# Altium schematic sheet RK3562-VCCIO4.SchDoc
size 420 x 297 mm; SheetNumber: 9; SheetTotal: 32
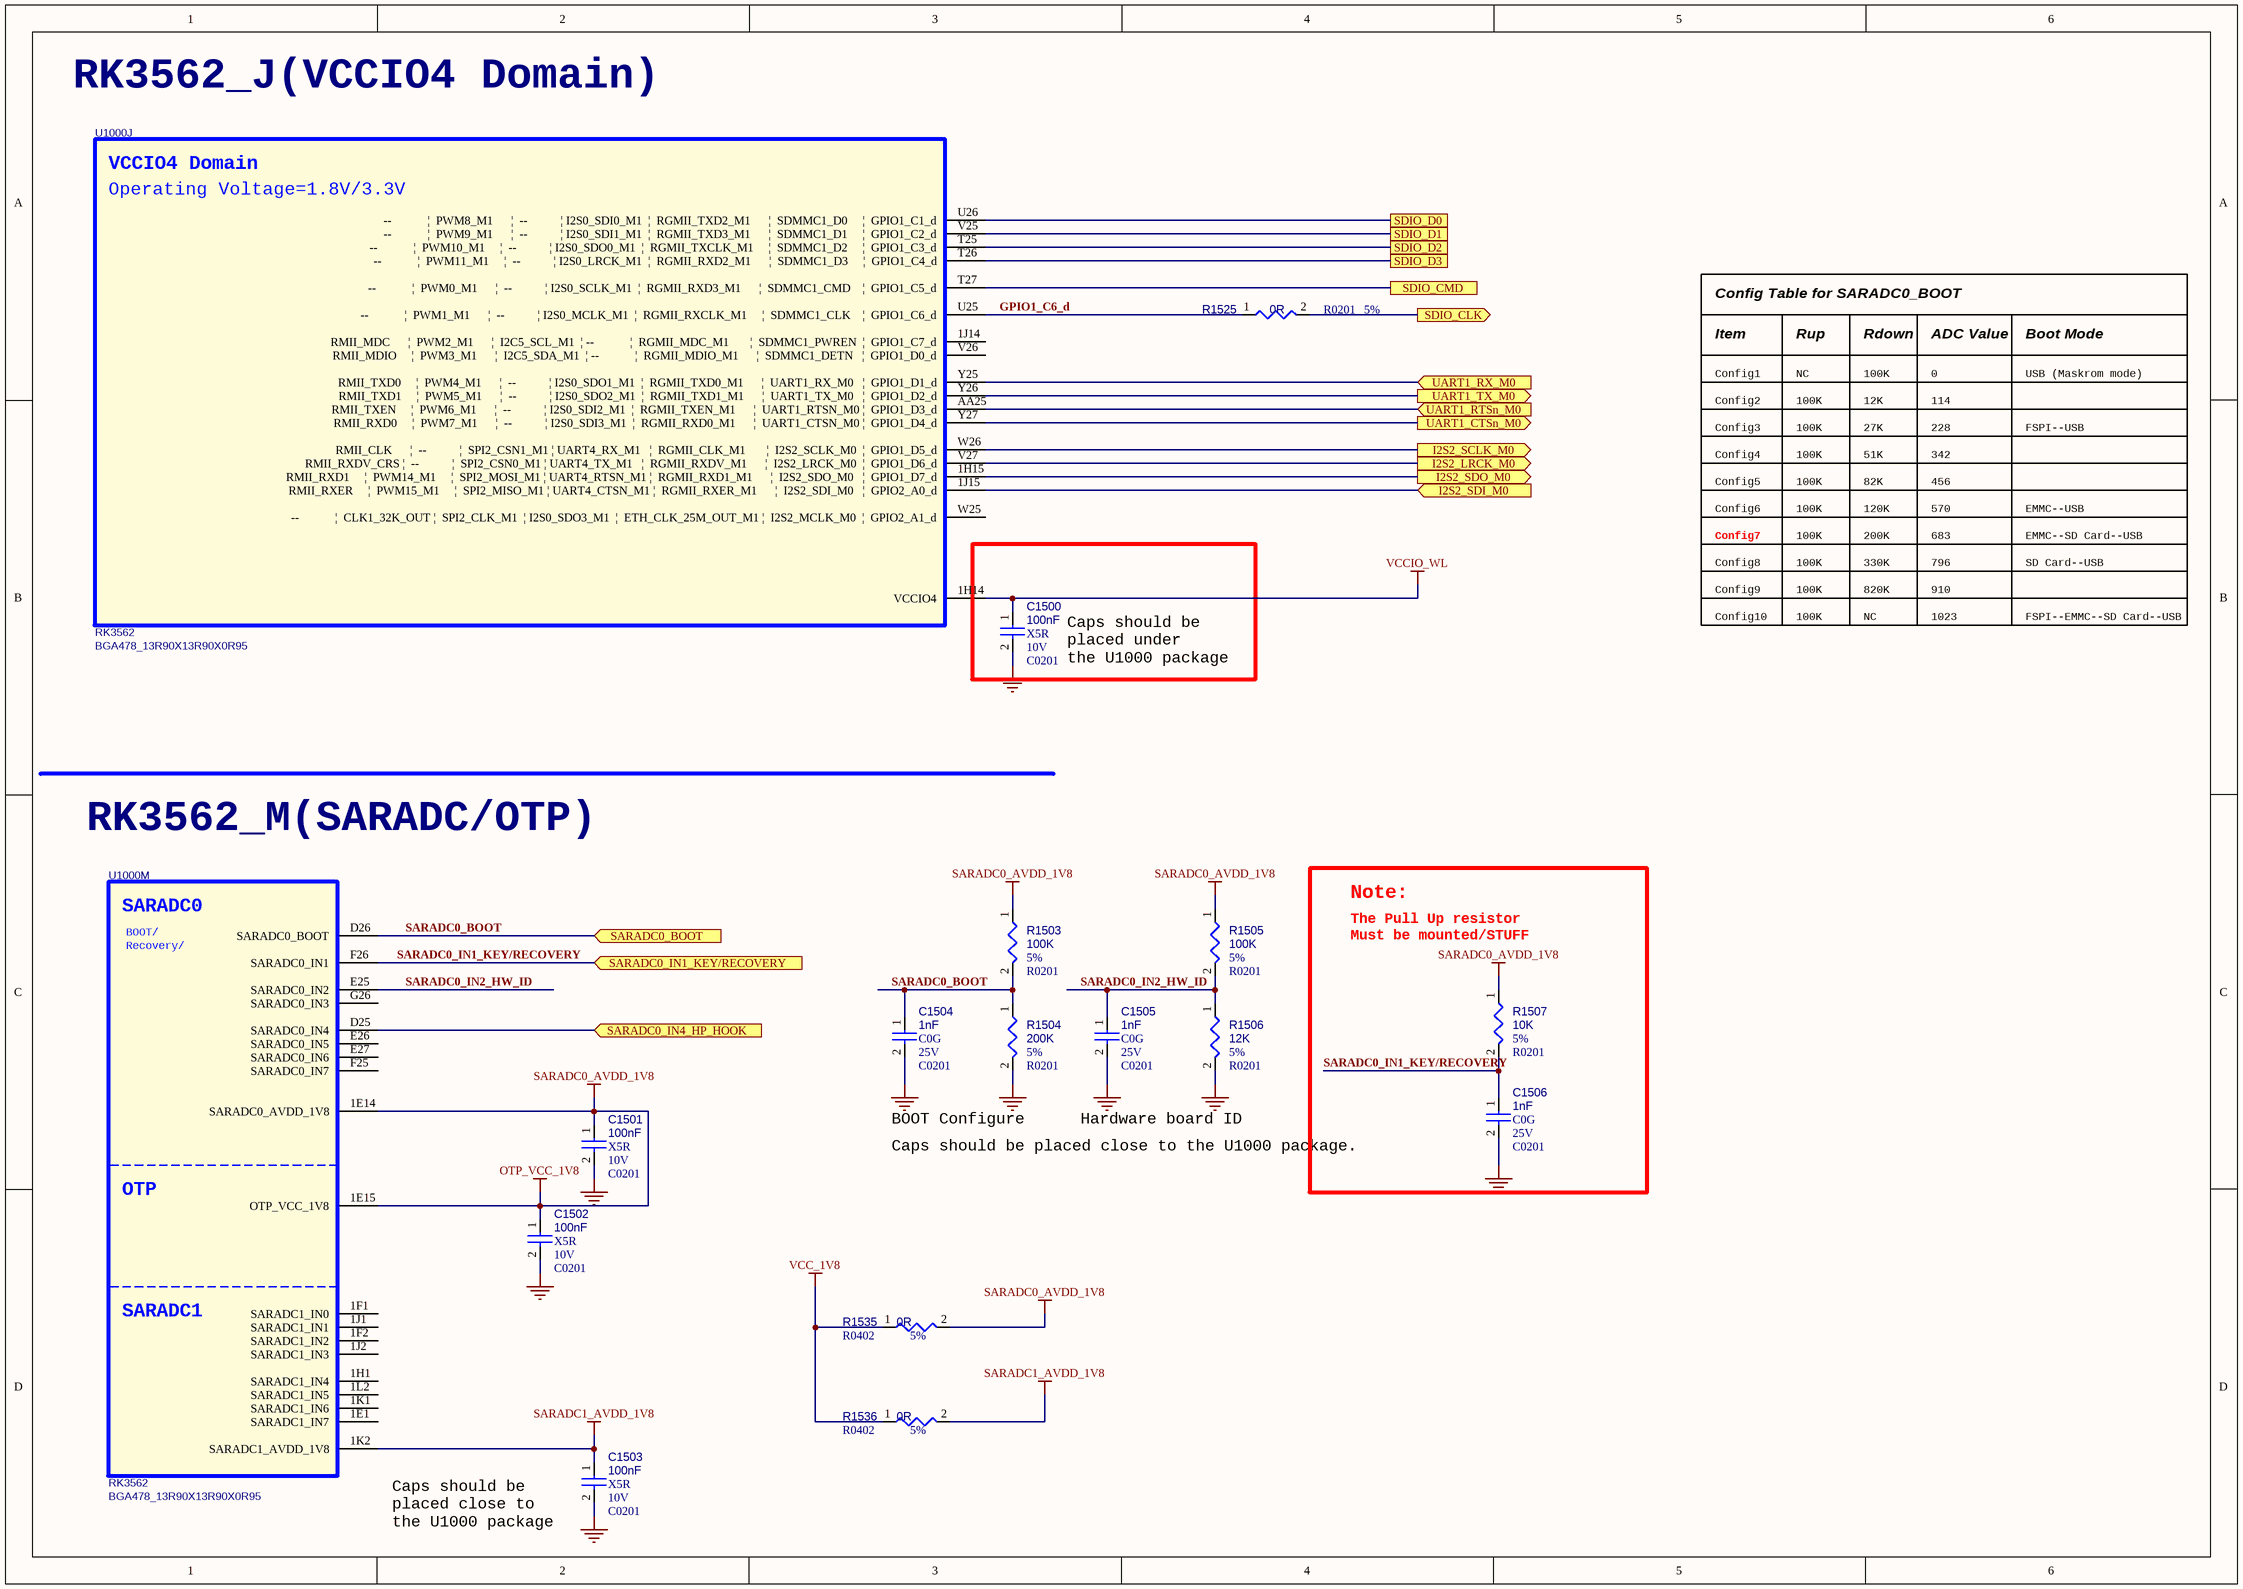
[diagram p0: RK3562-VCCIO4.SchDoc]

## Parts
C1500  100nF  Dielectric: X5R  Voltage: 10V  [C0201]
C1501  100nF  Dielectric: X5R  Voltage: 10V  [C0201]
C1502  100nF  Dielectric: X5R  Voltage: 10V  [C0201]
C1503  100nF  Dielectric: X5R  Voltage: 10V  [C0201]
C1504  1nF  Dielectric: C0G  Voltage: 25V  [C0201]
C1505  1nF  Dielectric: C0G  Voltage: 25V  [C0201]
C1506  1nF  Dielectric: C0G  Voltage: 25V  [C0201]
R1503  100K  Tolerance: 5%  [R0201]
R1504  200K  Tolerance: 5%  [R0201]
R1505  100K  Tolerance: 5%  [R0201]
R1506  12K  Tolerance: 5%  [R0201]
R1507  10K  Tolerance: 5%  [R0201]
R1525  0R  Tolerance: 5%  [R0201]
R1535  0R  Tolerance: 5%  [R0402]
R1536  0R  Tolerance: 5%  [R0402]
U1000  RK3562  [BGA478_13R90X13R90X0R95]  (parts J,M of 16)

## Blocks framed on the sheet
Note:: C1506 R1507

## Ports
I2S2_LRCK_M0 (out, see CONTROLLER-RK3562[4B], CONTROLLER-RK3562[3B], WF-BT-AP6256[1A]), I2S2_SCLK_M0 (out, see CONTROLLER-RK3562[4B], CONTROLLER-RK3562[3B], WF-BT-AP6256[1A]), I2S2_SDI_M0 (in, see CONTROLLER-RK3562[4B], CONTROLLER-RK3562[3B], WF-BT-AP6256[1B]), I2S2_SDO_M0 (out, see CONTROLLER-RK3562[4B], CONTROLLER-RK3562[3B], WF-BT-AP6256[1B]), SARADC0_BOOT (in, see CONTROLLER-RK3562[4B]), SARADC0_IN1_KEY/RECOVERY (in, see CONTROLLER-RK3562[4B]), SARADC0_IN4_HP_HOOK (in, see CONTROLLER-RK3562[4B]), SDIO_CLK (out, see CONTROLLER-RK3562[4B], CONTROLLER-RK3562[3B], WF-BT-AP6256[1A]), SDIO_CMD (see CONTROLLER-RK3562[4B], CONTROLLER-RK3562[3B], WF-BT-AP6256[1A]), SDIO_D0 (see CONTROLLER-RK3562[4B], CONTROLLER-RK3562[3B], WF-BT-AP6256[1A]), SDIO_D1 (see CONTROLLER-RK3562[4B], CONTROLLER-RK3562[3B], WF-BT-AP6256[1A]), SDIO_D2 (see CONTROLLER-RK3562[4B], CONTROLLER-RK3562[3B], WF-BT-AP6256[1A]), SDIO_D3 (see CONTROLLER-RK3562[4B], CONTROLLER-RK3562[3B], WF-BT-AP6256[1A]), UART1_CTSn_M0 (out, see CONTROLLER-RK3562[4B], CONTROLLER-RK3562[3B], WF-BT-AP6256[1A]), UART1_RTSn_M0 (in, see CONTROLLER-RK3562[4B], CONTROLLER-RK3562[3B], WF-BT-AP6256[1A]), UART1_RX_M0 (in, see CONTROLLER-RK3562[4B]), UART1_TX_M0 (out, see CONTROLLER-RK3562[4B])

## Nets
GND: C1500.2 C1501.2 C1502.2 C1503.2 C1504.2 C1505.2 C1506.2 R1504.2 R1506.2
OTP_VCC_1V8: C1501.1 C1502.1 R1503.1 R1505.1 R1507.1 R1535.2 U1000.1E14(SARADC0_AVDD_1V8) U1000.1E15(OTP_VCC_1V8)  [also labelled SARADC0_AVDD_1V8]
SARADC1_AVDD_1V8: C1503.1 R1536.2 U1000.1K2(SARADC1_AVDD_1V8)
VCC_1V8: R1535.1 R1536.1
VCCIO_WL: C1500.1 U1000.1H14(VCCIO4)
GPIO1_C6_d: R1525.1 U1000.U25(--____________|__PWM1_M1______|__--___________|_I2S0_MCLK_M1__|__RGMII_RXCLK_M1_____|__SDMMC1_CLK____|__GPIO1_C6_d)
I2S2_LRCK_M0: U1000.V27(RMII_RXDV_CRS_|__--___________|__SPI2_CSN0_M1_|_UART4_TX_M1___|__RGMII_RXDV_M1______|__I2S2_LRCK_M0__|__GPIO1_D6_d) ; port I2S2_LRCK_M0
I2S2_SCLK_M0: U1000.W26(RMII_CLK______|__--___________|__SPI2_CSN1_M1_|_UART4_RX_M1___|__RGMII_CLK_M1_______|__I2S2_SCLK_M0__|__GPIO1_D5_d) ; port I2S2_SCLK_M0
I2S2_SDI_M0: U1000.1J15(RMII_RXER_____|__PWM15_M1_____|__SPI2_MISO_M1_|_UART4_CTSN_M1_|__RGMII_RXER_M1______|__I2S2_SDI_M0___|__GPIO2_A0_d) ; port I2S2_SDI_M0
I2S2_SDO_M0: U1000.1H15(RMII_RXD1_____|__PWM14_M1_____|__SPI2_MOSI_M1_|_UART4_RTSN_M1_|__RGMII_RXD1_M1______|__I2S2_SDO_M0___|__GPIO1_D7_d) ; port I2S2_SDO_M0
SARADC0_BOOT: C1504.1 R1503.2 R1504.1 U1000.D26(SARADC0_BOOT) ; port SARADC0_BOOT
SARADC0_IN1_KEY/RECOVERY: C1506.1 R1507.2 U1000.F26(SARADC0_IN1) ; port SARADC0_IN1_KEY/RECOVERY
SARADC0_IN2_HW_ID: C1505.1 R1505.2 R1506.1 U1000.E25(SARADC0_IN2)
SARADC0_IN4_HP_HOOK: U1000.D25(SARADC0_IN4) ; port SARADC0_IN4_HP_HOOK
SDIO_CLK: R1525.2 ; port SDIO_CLK
SDIO_CMD: U1000.T27(--____________|__PWM0_M1______|__--___________|_I2S0_SCLK_M1__|__RGMII_RXD3_M1______|__SDMMC1_CMD____|__GPIO1_C5_d) ; port SDIO_CMD
SDIO_D0: U1000.U26(--____________|__PWM8_M1______|__--___________|_I2S0_SDI0_M1__|__RGMII_TXD2_M1______|__SDMMC1_D0_____|__GPIO1_C1_d) ; port SDIO_D0
SDIO_D1: U1000.V25(--____________|__PWM9_M1______|__--___________|_I2S0_SDI1_M1__|__RGMII_TXD3_M1______|__SDMMC1_D1_____|__GPIO1_C2_d) ; port SDIO_D1
SDIO_D2: U1000.T25(--____________|__PWM10_M1_____|__--___________|_I2S0_SDO0_M1__|__RGMII_TXCLK_M1_____|__SDMMC1_D2_____|__GPIO1_C3_d) ; port SDIO_D2
SDIO_D3: U1000.T26(--____________|__PWM11_M1_____|__--___________|_I2S0_LRCK_M1__|__RGMII_RXD2_M1______|__SDMMC1_D3_____|__GPIO1_C4_d) ; port SDIO_D3
UART1_CTSn_M0: U1000.Y27(RMII_RXD0_____|__PWM7_M1______|__--___________|_I2S0_SDI3_M1__|__RGMII_RXD0_M1______|__UART1_CTSN_M0_|__GPIO1_D4_d) ; port UART1_CTSn_M0
UART1_RTSn_M0: U1000.AA25(RMII_TXEN_____|__PWM6_M1______|__--___________|_I2S0_SDI2_M1__|__RGMII_TXEN_M1______|__UART1_RTSN_M0_|__GPIO1_D3_d) ; port UART1_RTSn_M0
UART1_RX_M0: U1000.Y25(RMII_TXD0_____|__PWM4_M1______|__--___________|_I2S0_SDO1_M1__|__RGMII_TXD0_M1______|__UART1_RX_M0___|__GPIO1_D1_d) ; port UART1_RX_M0
UART1_TX_M0: U1000.Y26(RMII_TXD1_____|__PWM5_M1______|__--___________|_I2S0_SDO2_M1__|__RGMII_TXD1_M1______|__UART1_TX_M0___|__GPIO1_D2_d) ; port UART1_TX_M0

Not connected (* = marked no-connect by the designer): U1000 1E1(SARADC1_IN7) 1F1(SARADC1_IN0) 1F2(SARADC1_IN2) 1H1(SARADC1_IN4) 1J1(SARADC1_IN1) 1J2(SARADC1_IN3) 1J14(RMII_MDC______|__PWM2_M1______|__I2C5_SCL_M1__|_--____________|__RGMII_MDC_M1_______|__SDMMC1_PWREN__|__GPIO1_C7_d) 1K1(SARADC1_IN6) 1L2(SARADC1_IN5) E26(SARADC0_IN5) E27(SARADC0_IN6) F25(SARADC0_IN7) G26(SARADC0_IN3) V26(RMII_MDIO_____|__PWM3_M1______|__I2C5_SDA_M1__|_--____________|__RGMII_MDIO_M1______|__SDMMC1_DETN___|__GPIO1_D0_d) W25(--____________|__CLK1_32K_OUT_|__SPI2_CLK_M1__|_I2S0_SDO3_M1__|__ETH_CLK_25M_OUT_M1_|__I2S2_MCLK_M0__|__GPIO2_A1_d)

## Notes on the sheet
- RK3562_J(VCCIO4 Domain)
- Config Table for SARADC0_BOOT
- Item
- Config1
- Rup
- NC
- Rdown
- 100K
- ADC Value
- 0
- Boot Mode
- USB (Maskrom mode)
- Config2
- Config3
- Config4
- 12K
- 27K
- 51K
- 114
- 228
- 342
- FSPI--USB
- Config5
- Config6
- 82K
- 120K
- 456
- 570
- EMMC--USB
- Config7
- Config8
- Config9
- 200K
- 330K
- 820K
- 683
- 796
- 910
- EMMC--SD Card--USB
- SD Card--USB
- Caps should be
  placed under
  the U1000 package
- Config10
- 1023
- FSPI--EMMC--SD Card--USB
- RK3562_M(SARADC/OTP)
- The Pull Up resistor
  Must be mounted/STUFF
- BOOT Configure
- Hardware board ID
- Caps should be placed close to the U1000 package.
- (near C1503) Caps should be
  placed close to
  the U1000 package
- (in symbol SOC_RK3562, part J) VCCIO4 Domain; Operating Voltage=1.8V/3.3V
- (in symbol SOC_RK3562, part M) SARADC0; BOOT/; Recovery/; OTP; SARADC1

## Library data of the parts
C1500 = CAP NP: cap,100.00nF,+/-10%,10V,X5R,C0201; Part Reference: C1500; Manufacturer: TDK; RK PN: C0603X5R1A104K030BC; Priority: A; Tolerance: 10%; PCB Footprint: C0201; Value: 100nF; Part Type: C0201; Manufacturer PN: C0603X5R1A104K030BC; Created by: JJJ; ClassName: RK
C1501 = CAP NP: cap,100.00nF,+/-10%,10V,X5R,C0201; Part Reference: C1501; Manufacturer: TDK; RK PN: C0603X5R1A104K030BC; Priority: A; Tolerance: 10%; PCB Footprint: C0201; Value: 100nF; Part Type: C0201; Manufacturer PN: C0603X5R1A104K030BC; Created by: JJJ; ClassName: RK
C1502 = CAP NP: cap,100.00nF,+/-10%,10V,X5R,C0201; Part Reference: C1502; Manufacturer PN: C0603X5R1A104K030BC; Manufacturer: TDK; Tolerance: 10%; Priority: A; PCB Footprint: C0201; Value: 100nF; Created by: JJJ; Part Type: C0201; RK PN: C0603X5R1A104K030BC; ClassName: RK
C1503 = CAP NP: cap,100.00nF,+/-10%,10V,X5R,C0201; Part Reference: C1503; Manufacturer: TDK; RK PN: C0603X5R1A104K030BC; Priority: A; Tolerance: 10%; PCB Footprint: C0201; Value: 100nF; Part Type: C0201; Manufacturer PN: C0603X5R1A104K030BC; Created by: JJJ; ClassName: RK
C1504 = CAP NP: 一般用片状陶瓷电容(GRM),cap,1nF,±5%,25V,C0G,C0201; Part Reference: C1504; Manufacturer PN: GRM0335C1E102JA01; Manufacturer: murata; Priority: A; RK PN: 902004752; PCB Footprint: C0201; Value: 1nF; Created by: JJJ; Tolerance: ±5%; Part Type: 一般用片状陶瓷电容; ClassName: RK
C1505 = CAP NP: 一般用片状陶瓷电容(GRM),cap,1nF,±5%,25V,C0G,C0201; Part Reference: C1505; Manufacturer: murata; Manufacturer PN: GRM0335C1E102JA01; RK PN: 902004752; Priority: A; PCB Footprint: C0201; Value: 1nF; Part Type: 一般用片状陶瓷电容; Tolerance: ±5%; Created by: JJJ; ClassName: RK
C1506 = CAP NP: 一般用片状陶瓷电容(GRM),cap,1nF,±5%,25V,C0G,C0201; Part Reference: C1506; Manufacturer: murata; Manufacturer PN: GRM0335C1E102JA01; RK PN: 902004752; Priority: A; PCB Footprint: C0201; Value: 1nF; Part Type: 一般用片状陶瓷电容; Tolerance: ±5%; Created by: JJJ; ClassName: RK
R1503 = RESISTOR: 通用厚膜电阻,100K,+/-5%,R0201,1/20W.; Part Reference: R1503; Manufacturer: YAGEO; Manufacturer PN: RC0201JR-07100KL; RK PN: 901000474; Priority: A; Wattage: 1/20W; PCB Footprint: R0201; Value: 100K; Part Type: 通用厚膜电阻; Created by: YTL; ClassName: RK
R1504 = RESISTOR: 通用厚膜电阻,200K,+/-5%,R0201,1/20W.; Part Reference: R1504; Manufacturer: YAGEO; Manufacturer PN: RC0201JR-07200KL; RK PN: 901000516; Priority: A; Wattage: 1/20W; PCB Footprint: R0201; Value: 200K; Part Type: 通用厚膜电阻; Created by: YTL; ClassName: RK
R1505 = RESISTOR: 通用厚膜电阻,100K,+/-5%,R0201,1/20W.; Part Reference: R1505; Manufacturer PN: RC0201JR-07100KL; Manufacturer: YAGEO; Wattage: 1/20W; Priority: A; RK PN: 901000474; PCB Footprint: R0201; Value: 100K; Created by: YTL; Part Type: 通用厚膜电阻; ClassName: RK
R1506 = RESISTOR: 通用厚膜电阻,12K,+/-5%,R0201,1/20W.; Part Reference: R1506; Manufacturer: YAGEO; Manufacturer PN: RC0201JR-0712KL; RK PN: 901000485; Priority: A; Wattage: 1/20W; PCB Footprint: R0201; Value: 12K; Part Type: 通用厚膜电阻; Created by: YTL; ClassName: RK
R1507 = RESISTOR: 通用厚膜电阻,10K,+/-5%,R0201,1/20W.; Part Reference: R1507; Manufacturer PN: RC0201JR-0710KL; Manufacturer: YAGEO; Wattage: 1/20W; Priority: A; RK PN: 901000476; PCB Footprint: R0201; Value: 10K; Created by: YTL; Part Type: 通用厚膜电阻; ClassName: RK
R1525 = RESISTOR: 通用厚膜电阻,0R,+/-5%,R0201,1/20W.; Part Reference: R1525; Manufacturer: YAGEO; Manufacturer PN: RC0201JR-070RL; RK PN: 901000473; Priority: A; Wattage: 1/20W; PCB Footprint: R0201; Value: 0R; Part Type: 通用厚膜电阻; Created by: YTL; ClassName: RK
R1535 R1536 = RESISTOR: 通用厚膜电阻,0R,+/-5%,R0402,1/16W.; Part Reference: R1604; Manufacturer PN: RC0402JR-070RL; Manufacturer: YAGEO; Wattage: 1/16W; Priority: A; RK PN: 901001446; PCB Footprint: R0402; Value: 0R; Created by: YTL; Part Type: 通用厚膜电阻; ClassName: RK
U1000 = SOC_RK3562: ROCKCHIP SOC; Part Reference: U1000; Manufacturer: Rockchip (瑞芯微); SPLIT_INST: TRUE; SWAP_INFO: (S1+S2+S3+S4+S5+S6+S7+S8+S9+S10+S11+S12+S13+S14+S15+S16); RK PN: 906000425; Priority: A; PCB Footprint: BGA478_13R90X13R90X0R95; Value: RK3562; Part Type: SOC; Manufacturer PN: RK3562; Created by: JJJ; ClassName: RK